# EasyEDA Pro project Choloepus.eprj, board PCB1
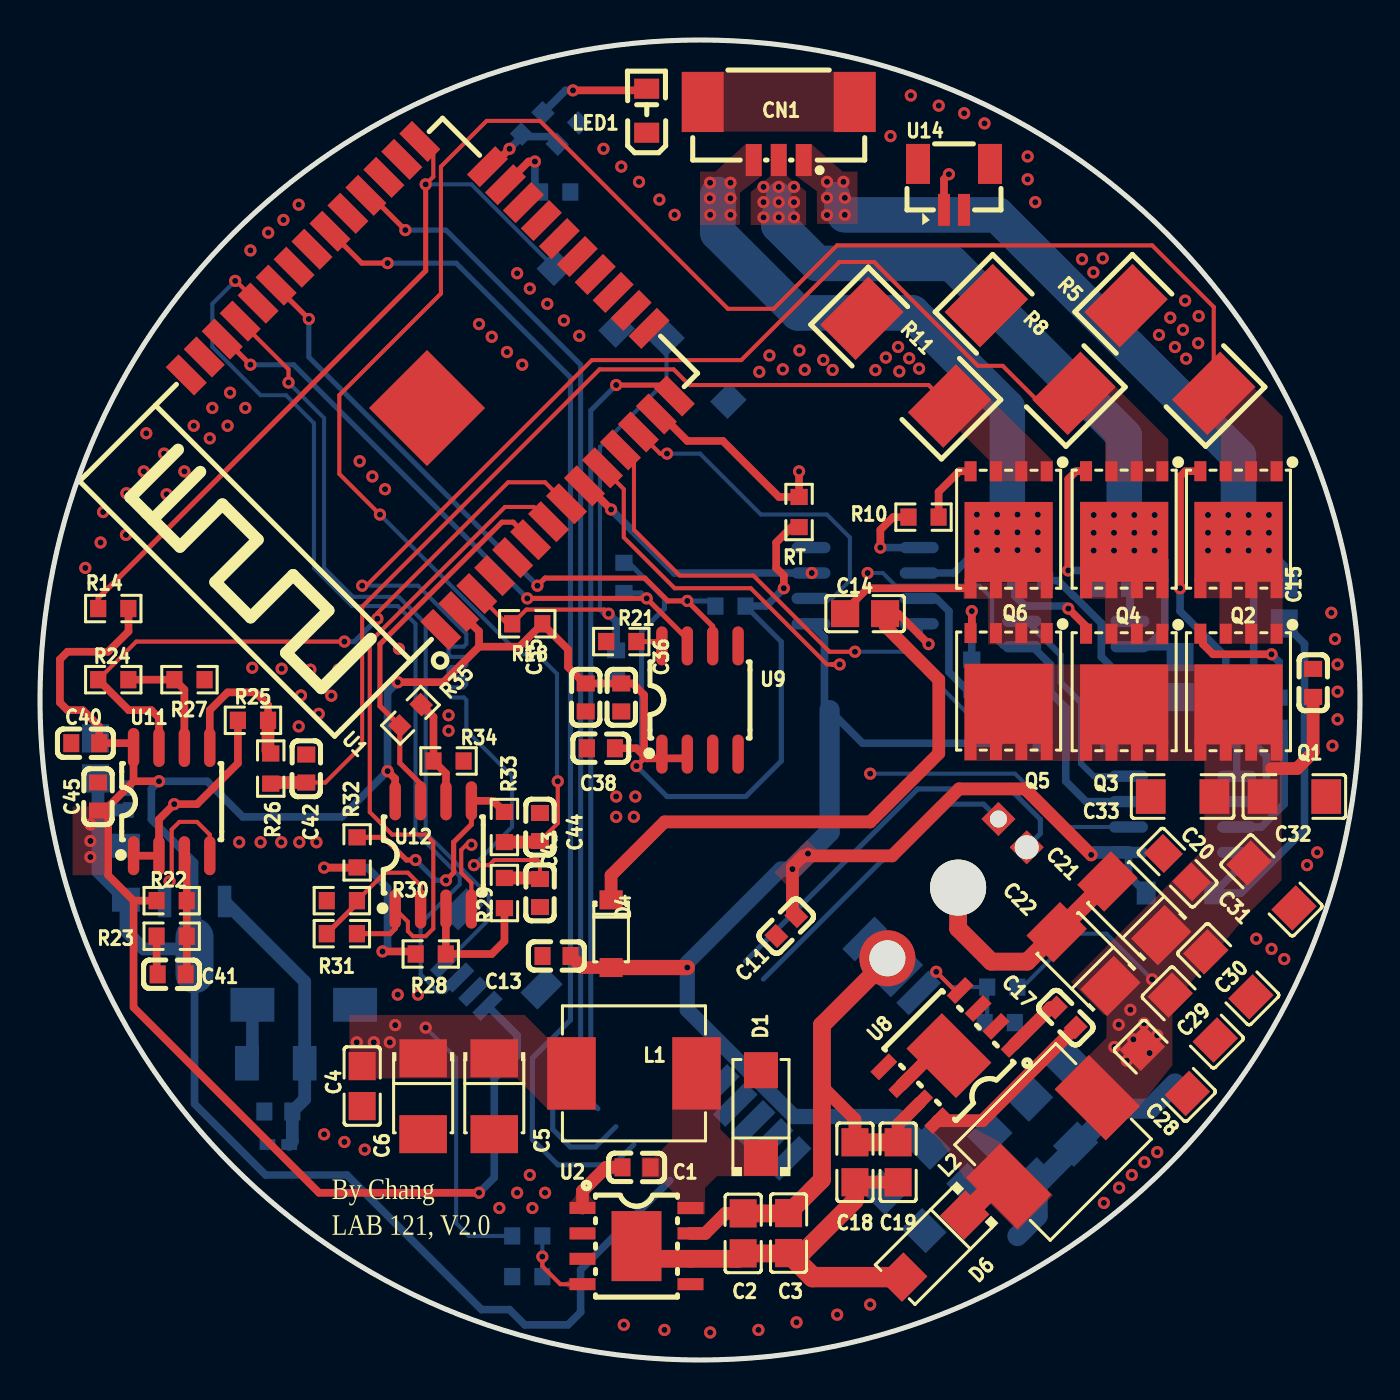
[diagram p2: board, top side]
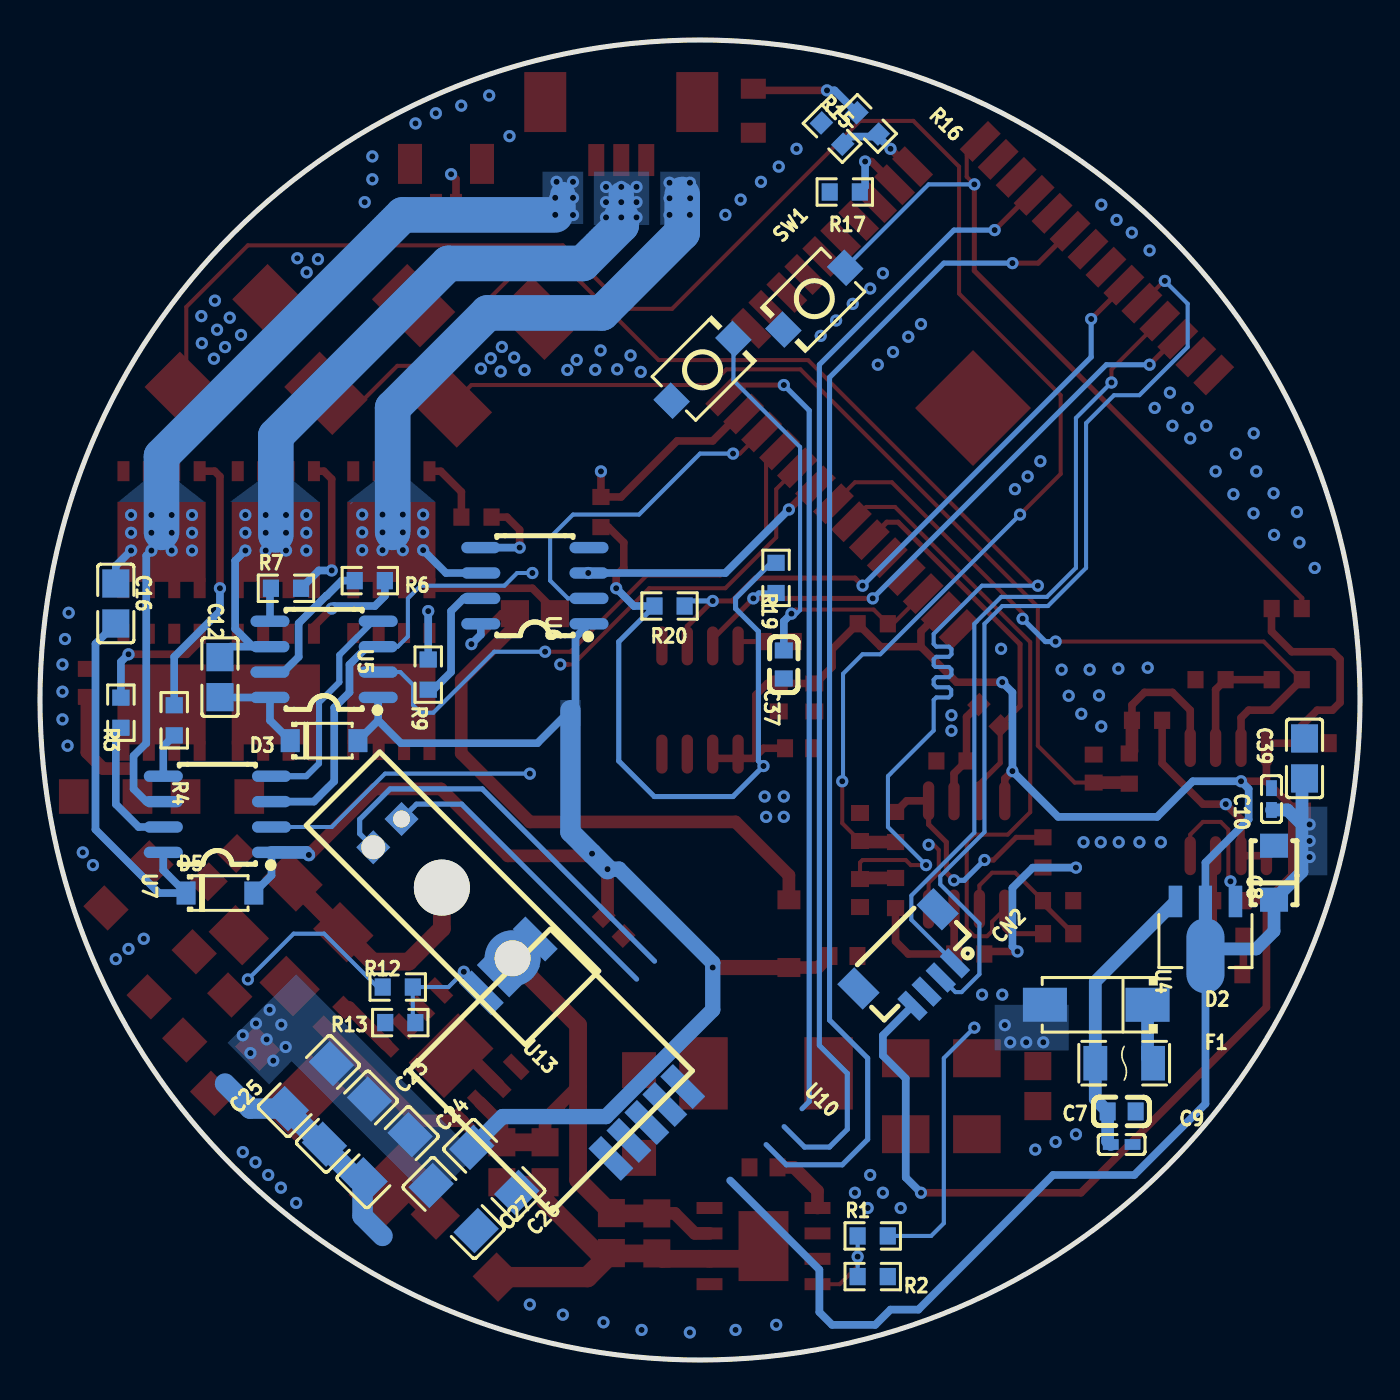
[diagram p3: board, bottom side, seen from below]

Outline 66 x 66 mm; copper layers: Top Layer, Inner1, Inner2, Inner3, Inner4, Bottom Layer. Coordinates in mm from the lower left corner of the outline.
Outline path: circle c33,33 r33
Stack: Top Layer 0.035mm 外层铜厚1oz / Dielectric1 0.0994mm 3313 RC57% 4.2mil / Inner1 0.0152mm 内层铜厚 / Dielectric2 0.55mm 0.55mm H/H不含铜 / Inner2 0.0152mm 内层铜厚 / Dielectric3 0.1088mm 2116 RC54% 4.9mil / Inner3 0.0152mm 内层铜厚 / Dielectric4 0.55mm 0.55mm H/H不含铜 / Inner4 0.0152mm 内层铜厚 / Dielectric5 0.0994mm 3313 RC57% 4.2mil / Bottom Layer 0.035mm 外层铜厚1oz

## Design rules (mm)
template: 自定义配置
spacing copperThickness1oz (default): track to track 0.102, other pairs 0.152 to 0.3
spacing copperThickness2oz: track to track 0.203, other pairs 0.152 to 0.3
track width copperThickness1oz (default): min 0.127, default 0.254, max 2.54
track width copperThickness2oz: min 0.203, default 0.254, max 2.54
differential pair differentialPair (default): width min 0.127, default 0.254, max 2.54; gap min 0.152, default 0.152
via viaSize (default): diameter min 0.5, default 0.61, max 10; hole min 0.3, default 0.305, max 6.3

## Placement (name value [footprint] x y rotation side)
C1  10nF  [C0603]  29.82 9.63 180 top
C2  10uF  [C0805]  35.16 6.33 90 top
C3  10uF  [C0805]  37.43 6.35 90 top
C4  10uF  [C0805]  16.11 13.7 90 top
C5  47uF  [CAP-SMD_L3.5-W2.8-R-RD]  22.71 13.19 90 top
C6  47uF  [CAP-SMD_L3.5-W2.8-R-RD]  19.16 13.19 90 top
C7  22uF  [C0603]  11.92 12.43 180 bottom
C8  22uF  [CAP-SMD_L3.2-W1.6]  4.3 24.36 90 bottom
C9  100nF  [C0402]  11.92 10.78 0 bottom
C10  100nF  [C0402]  4.42 28.05 270 bottom
C11  100nF  [C0603]  37.32 21.7 45 top
C12  10uF  [C0805]  57 34.14 270 bottom
C13  100nF  [C0603]  25.83 20.2 0 top
C14  10uF  [C0805]  41.25 37.32 0 top
C15  100nF  [C0603]  63.66 33.86 270 top
C16  10uF  [C0805]  62.21 37.83 270 bottom
C17  10nF  [C0603]  51.29 17.12 135 top
C18  10uF  [C0805]  40.75 9.89 90 top
C19  10uF  [C0805]  42.91 9.89 90 top
C20  10uF  [C0805]  56.88 24.62 315 top
C21  47uF  [CAP-SMD_L3.5-W2.8-R-RD]  54.72 22.59 315 top
C22  47uF  [CAP-SMD_L3.5-W2.8-R-RD]  52.18 20.05 315 top
C23  22uF  [C1206]  50.65 11.92 135 bottom
C24  22uF  [C1206]  48.62 10.14 135 bottom
C25  22uF  [C1206]  52.56 13.7 135 bottom
C26  22uF  [C1206]  43.29 9.5 45 bottom
C27  22uF  [C1206]  45.32 7.6 45 bottom
C28  22uF  [C1206]  56.24 14.46 135 top
C29  22uF  [C1206]  57.64 17.12 135 top
C30  22uF  [C1206]  59.42 19.28 135 top
C31  22uF  [C1206]  61.57 23.73 135 top
C32  22uF  [C1206]  62.72 28.17 180 top
C33  22uF  [C1206]  57.13 28.17 0 top
C35  100nF  [C0603]  27.28 33.13 270 top
C36  100nF  [C0603]  29.06 33.13 270 top
C37  100nF  [C0603]  28.81 34.78 90 bottom
C38  100nF  [C0603]  28.05 30.59 0 top
C39  10uF  [C0805]  2.77 30.08 270 bottom
C40  100nF  [C0603]  2.26 30.84 180 top
C41  100nF  [C0603]  6.58 19.28 0 top
C42  2.2nF  [C0603]  13.31 29.57 90 top
C43  2.2nF  [C0603]  25 23.35 270 top
C44  2.2nF  [C0603]  25 26.65 90 top
C45  100nF  [C0603]  2.9 28.17 90 top
CN1  YTC-A1251-03ABW  [CONN-SMD_3P-P1.25_YTC-A1251-03ABW]  36.94 61.45 180 top
CN2  YTC-A1001LF-04A  [CONN-TH_YTC-A1001LF-04A]  22.21 19.67 315 bottom
D1  B340A-13-F  [SMA_L4.4-W2.6-LS5.0-RD]  36.05 12.3 90 top
D2  SS14  [SMA_L4.2-W2.6-LS5.3-RD]  13.19 17.76 0 bottom
D3  FR107  [SOD-123_L2.8-W1.8-LS3.7-RD]  51.8 30.97 180 bottom
D4  FR107  [SOD-123_L2.8-W1.8-LS3.7-RD]  28.56 21.32 270 top
D5  FR107  [SOD-123_L2.8-W1.8-LS3.7-RD]  57 23.35 180 bottom
D6  B340A-13-F  [SMA_L4.4-W2.6-LS5.0-RD]  44.68 5.69 225 top
F1  BSMD1206-100-24V  [F1206]  11.79 14.84 0 bottom
L1  22uH  [IND-SMD_L7.0-W6.6_FXL0630]  29.7 14.33 180 top
L2  22uH  [IND-SMD_L7.0-W6.6_FXL0630]  50.65 10.9 45 top
LED1  XL-2012UGC  [LED0805-RD_GREEN]  30.33 62.46 90 top
Q1  HYG025N06LS1C2  [DFN-8_L5.9-W5.2-P1.27-LS6.2-BL]  59.92 33.39 180 top
Q2  HYG025N06LS1C2  [DFN-8_L5.9-W5.2-P1.27-LS6.2-BL]  59.92 41.52 180 top
Q3  HYG025N06LS1C2  [DFN-8_L5.9-W5.2-P1.27-LS6.2-BL]  54.21 33.39 180 top
Q4  HYG025N06LS1C2  [DFN-8_L5.9-W5.2-P1.27-LS6.2-BL]  54.21 41.52 180 top
Q5  HYG025N06LS1C2  [DFN-8_L5.9-W5.2-P1.27-LS6.2-BL]  48.43 33.42 180 top
Q6  HYG025N06LS1C2  [DFN-8_L5.9-W5.2-P1.27-LS6.2-BL]  48.43 41.51 180 top
R1  20kΩ  [R0603]  24.36 6.2 180 bottom
R2  6.46K  [R0603]  24.36 4.17 0 bottom
R3  22Ω  [R0603]  61.96 32.36 90 bottom
R4  22Ω  [R0603]  59.29 31.98 90 bottom
R5  5mΩ  [RES-SMD_L6.4-W3.2-1]  56.5 50.53 315 top
R6  22Ω  [R0603]  49.51 38.97 180 bottom
R7  22Ω  [R0603]  53.7 38.59 180 bottom
R8  5mΩ  [RES-SMD_L6.4-W3.2-1]  49.51 50.53 315 top
R9  22Ω  [R0603]  46.59 34.27 90 bottom
R10  22Ω  [R0603]  44.18 42.14 0 top
R11  5mΩ  [RES-SMD_L6.4-W3.2-1]  43.29 49.89 315 top
R12  20kΩ  [R0603]  48.11 18.65 0 bottom
R13  2.27K  [R0603]  47.99 16.87 180 bottom
R14  10kΩ  [R0603]  3.66 37.57 0 top
R15  10kΩ  [R0603]  26.4 61.32 45 bottom
R16  3.3kΩ  [R0603]  24.62 61.83 45 bottom
R17  10kΩ  [R0603]  25.76 58.4 0 bottom
R18  10kΩ  [R0603]  24.36 36.81 0 top
R19  4.7kΩ  [R0603]  29.2 39.1 90 bottom
R20  4.7kΩ  [R0603]  34.52 37.7 0 bottom
R21  10kΩ  [R0603]  29.06 35.92 0 top
R22  20kΩ  [R0603]  6.58 22.97 180 top
R23  20kΩ  [R0603]  6.58 21.19 0 top
R24  20kΩ  [R0603]  3.66 34.02 180 top
R25  20kΩ  [R0603]  10.65 31.98 0 top
R26  2kΩ  [R0603]  11.54 29.57 90 top
R27  2kΩ  [R0603]  7.47 34.02 180 top
R28  20kΩ  [R0603]  19.54 20.3 0 top
R29  2kΩ  [R0603]  23.22 23.35 270 top
R30  2kΩ  [R0603]  15.09 22.97 0 top
R31  20kΩ  [R0603]  15.09 21.32 0 top
R32  20kΩ  [R0603]  15.85 25.38 90 top
R33  2kΩ  [R0603]  23.22 26.65 90 top
R34  2kΩ  [R0603]  20.43 29.95 180 top
R35  20kΩ  [R0603]  18.52 32.24 225 top
RT  NC  [R0603]  37.95 42.4 270 top
SW1  TS-1088-AR02016  [SW-SMD_L3.9-W3.0-P4.45]  27.28 53.07 315 bottom
SW2  TS-1088-AR02016  [SW-SMD_L3.9-W3.0-P4.45]  32.87 49.51 135 bottom
U1  ESP32-WROOM-32-N4  [WIFIM-SMD_ESP32-WROOM-32-N4]  20.05 49.26 135 top
U2  TPS5430DDAR  [ESOP-8_L4.9-W3.9-P1.27-LS6.0-TL-EP]  29.82 5.69 0 top
U4  CJA1117B-3.3  [SOT-89-3_L4.5-W2.5-P1.50-LS4.2-BR]  7.73 21.57 90 bottom
U5  EG2104S  [SOIC-8_L5.0-W4.0-P1.27-LS6.0-BL]  51.8 35.03 90 bottom
U6  EG2104S  [SOIC-8_L5.0-W4.0-P1.27-LS6.0-BL]  41.25 38.72 90 bottom
U7  EG2104S  [SOIC-8_L5.0-W4.0-P1.27-LS6.0-BL]  57.13 27.28 90 bottom
U8  TPS5430DDAR  [ESOP-8_L4.9-W3.9-P1.27-LS6.0-TL-EP]  45.45 15.22 225 top
U9  AS5600-ASOT  [SOIC-8_L5.0-W4.0-P1.27-LS6.0-BL]  33 33 0 top
U10  -  [CAN-Niren-V2]  33.38 14.46 45 bottom
U11  LM358DR  [SOIC-8_L5.0-W4.0-P1.27-LS6.0-BL]  6.58 27.92 0 top
U12  LM358DR  [SOIC-8_L5.0-W4.0-P1.27-LS6.0-BL]  19.66 25.25 0 top
U13  -  [XT30PB(2+2)-M]  42.37 20.08 45 bottom
U14  XY-SH1.0-2A51  [CONN-SMD_2P-P1.00_XY-SH1.0-2A51]  45.7 58.65 0 top

## Footprints (pads in the part's own frame, mm; a bottom-side part is the same pattern mirrored in y, then rotated)
C0402
  rect 0.79x0.54 smd: 1(-0.545,0) 2(0.545,0)
C0603
  rect 0.8x0.9 smd: 1(-0.7,0) 2(0.7,0)
C0805
  rect 1.41x1.35 smd: 1(-1,0) 2(1,0)
C1206
  rect 1.485x1.728 smd: 1(-1.593,0) 2(1.593,0)
CAN-Niren-V2
  rect 2.286x0.889 smd: 1(-0.216,5.975) 2(-0.216,4.704) 3(-0.216,3.434) 4(-0.216,2.164) 5(-0.215,0.895) 6(10.216,0.894) 7(10.216,2.164) 8(10.216,3.434) 9(10.216,4.704)
CAP-SMD_L3.2-W1.6
  rect 1.2x1.4 smd: 1(-1.35,0) 2(1.35,0)
CAP-SMD_L3.5-W2.8-R-RD
  rect 1.9x2.376 smd: 1(1.899,0) 2(-1.899,0)
CONN-SMD_2P-P1.00_XY-SH1.0-2A51
  rect 0.6x1.6 smd: 1(-0.5,-1.15) 2(0.5,-1.15)
  rect 1.2x2 smd: 3(1.8,1.15) 4(-1.8,1.15)
CONN-SMD_3P-P1.25_YTC-A1251-03ABW
  rect 0.8x1.6 smd: 1(-1.25,1.45) 2(0,1.45) 3(1.25,1.45)
  rect 2.1x3 smd: 4(-3.8,-1.45) 5(3.8,-1.45)
CONN-TH_YTC-A1001LF-04A
  rect 0.6x1.55 smd: 1(-1.5,1.262) 2(-0.5,1.262) 3(0.5,1.262) 4(1.5,1.262)
  rect 1.2x1.8 smd: 5(2.8,-1.262) 6(-2.8,-1.262)
DFN-8_L5.9-W5.2-P1.27-LS6.2-BL
  rect 0.6x1 smd: 1(-1.905,-2.925) 2(-0.635,-2.925) 3(0.635,-2.925) 4(1.905,-2.925) 5(1.905,2.925) 6(0.635,2.925) 7(-0.635,2.925) 8(-1.905,2.925)
  rect 4.41x4 smd: 9(0,0.61)
ESOP-8_L4.9-W3.9-P1.27-LS6.0-TL-EP
  rect 1.3x0.6 smd: 1(-2.7,1.905) 2(-2.7,0.635) 3(-2.7,-0.635) 4(-2.7,-1.905) 5(2.7,-1.905) 6(2.7,-0.635) 7(2.7,0.635) 8(2.7,1.905)
  rect 2.5x3.5 smd: 9(0,0)
F1206
  rect 1.19x1.728 smd: 1(-1.445,0) 2(1.445,0)
IND-SMD_L7.0-W6.6_FXL0630
  rect 2.424x3.62 smd: 1(3.128,0) 2(-3.128,0)
LED0805-RD_GREEN
  rect 1x1.25 smd: 1(-1.1,0) 2(1.1,0)
R0603
  rect 0.806x0.864 smd: 1(-0.753,0) 2(0.753,0)
RES-SMD_L6.4-W3.2-1
  rect 2.5x3.4 smd: 1(-3.1,0) 2(3.1,0)
SMA_L4.2-W2.6-LS5.3-RD
  rect 2.2x1.7 smd: 1(-2.566,0) 2(2.566,0)
SMA_L4.4-W2.6-LS5.0-RD
  rect 1.8x1.7 smd: 1(-2.192,0) 2(2.192,0)
SOD-123_L2.8-W1.8-LS3.7-RD
  rect 0.95x1.15 smd: 1(-1.692,0) 2(1.692,0)
SOIC-8_L5.0-W4.0-P1.27-LS6.0-BL
  oval 0.569x1.95 smd: 1(-1.905,-2.705) 2(-0.635,-2.705) 3(0.635,-2.705) 4(1.905,-2.705) 5(1.905,2.705) 6(0.635,2.705) 7(-0.635,2.705) 8(-1.905,2.705)
SOT-89-3_L4.5-W2.5-P1.50-LS4.2-BR
  rect 1.575x0.672 smd: 1(1.356,-1.5) 3(1.356,1.5)
  custom 5.377x1.9 smd: 2(-1.356,0)
SW-SMD_L3.9-W3.0-P4.45
  rect 1.23x1.36 smd: 1(-2.185,0) 2(2.185,0)
WIFIM-SMD_ESP32-WROOM-32-N4
  rect 2x0.9 smd: 1(-9,9.005) 2(-9,7.735) 3(-9,6.465) 4(-9,5.195) 5(-9,3.925) 6(-9,2.655) 7(-9,1.385) 8(-9,0.115) 9(-9,-1.155) 10(-9,-2.425) 11(-9,-3.695) 12(-9,-4.965) 13(-9,-6.235) 14(-9,-7.505) 25(9,-7.505) 26(9,-6.235) 27(9,-4.965) 28(9,-3.695) 29(9,-2.425) 30(9,-1.155) 31(9,0.115) 32(9,1.385) 33(9,2.655) 34(9,3.925) 35(9,5.195) 36(9,6.465) 37(9,7.735) 38(9,9.005)
  rect 0.9x2 smd: 15(-5.715,-9.005) 16(-4.445,-9.005) 17(-3.175,-9.005) 18(-1.905,-9.005) 19(-0.635,-9.005) 20(0.635,-9.005) 21(1.905,-9.005) 22(3.175,-9.005) 23(4.445,-9.005) 24(5.715,-9.005)
  rect 4.1x4.1 smd: 39(-0.68,1.665)
XT30PB(2+2)-M
  round 2.8 hole 1.8: 1(0,0)
  round 2.8 hole 2.8x1.8: 2(5,0)
  rect 1.2x1.2 hole 1.8x0.85: 3(8.85,1)
  rect 1.2x1.2 hole 0.85: 4(8.85,-1)

## Nets
As in the schematic, except:
3V3: C8.1 C10.2 C35.1 C36.1 C38.2 C39.2 C40.1 C45.1 CN2.4 R14.2 R18.2 R19.2 R20.2 R22.2 RT.2 U1.2 U4.2 U9.1 U9.2 U10.1 U11.8 U12.8
TEMP: RT.1 U1.13 U14.1

Pads without a net: CN1 4 5; CN2 5 6; U1 4 5 16 17 18 19 20 21 22 26 27 29 31 32 37; U2 2 3 5; U8 2 3 5; U9 3 5; U10 9; U14 3 4

## Via types
v1: diameter 0.61, hole 0.305, Top Layer to Bottom Layer, 254 vias

## Routing (per net, layer and track width the routed paths; a pad name or vN(x,y) marks a point on that pad's centre or on a via; arc(x,y) is an arc through that point)
1V65: length 29.4
  Top Layer w0.381: R32.1 15.85,24.62 v1(14.2,24.62) ; v1(17.12,20.43) 18.66,20.43 R28.1 ; U11.1 U11.2 5.95,27.03 v1(6.71,27.79) 7.85,27.79 9.89,29.83 R25.1
  Inner2 w0.381: v1(14.2,24.62) 9.89,24.62 v1(6.71,27.79)
  Bottom Layer w0.381: v1(14.2,24.62) 16.36,24.62 17.38,23.6 17.38,20.68 v1(17.12,20.43)
3V3: length 204.6
  Top Layer w0.254: v1(29.82,29.7) 30.21,30.08 30.21,30.21
  Top Layer w0.381: 4.68,22.97 4.68,17.63 13.95,8.36 v1(21.95,8.36) ; 4.68,22.97 3.41,24.24 3.41,27.67 4.68,28.94 ; 4.68,22.97 R22.2 ; v1(5.95,28.94) 4.68,28.94 ; 4.68,28.94 U11.8 4.46,30.84 C40.1 2.96,31.67 2.14,32.49 1.38,32.49 1,32.87 1,35.03 1.38,35.41 3.41,35.41 4.42,36.43 4.42,37.56 R14.2 ; U1.2 20.96,37.42 21.95,36.43 21.95,35.67 ; U9.2 32.15,30.08 30.88,30.08 ; 21.95,35.67 20.17,33.89 v1(17.89,33.89) ; 21.95,35.67 23.97,35.67 R18.2 26.4,35.53 26.4,34.65 27.22,33.83 C35.1 C36.1 29.63,33.83 30.21,33.25 30.21,30.21 ; 30.88,30.08 30.33,30.08 30.21,30.21 ; 30.88,30.08 U9.1 ; 30.21,30.21 29.82,30.59 C38.2 ; v1(17.38,29.44) 17.76,29.06 U12.8 ; RT.2 37.58,41.64 36.81,40.87 36.81,39.6 37.19,39.22 v1(37.19,38.59)
  Bottom Layer w0.254: R19.2 29.44,39.86 31.22,38.08 31.22,37.57 30.08,36.43 30.08,29.95 v1(29.82,29.7) 31.35,28.17 35.29,28.17 37.06,29.95 37.06,35.91 R20.2
  Bottom Layer w0.381: 31.49,8.97 27.03,4.52 27.03,2.39 26.4,1.76 24.24,1.76 23.47,2.52 22.08,2.52 15.35,9.25 11.28,9.25 7.73,12.81 U4.2 7.73,24.87 5.57,27.03 5.57,28.56 v1(5.95,28.94) 8.36,28.94 10.14,27.16 15.09,27.16 v1(17.38,29.44) 17.38,33.38 v1(17.89,33.89) ; CN2.4 23.86,16.23 23.86,15.22 22.71,14.08 22.71,9.12 v1(21.95,8.36) ; v1(37.19,38.59) 36.3,37.7 R20.2
  Bottom Layer w0.635: C39.2 2.9,28.95 2.9,26.78 ; U4.2 7.39,20.55 5.19,20.55 4.3,21.44 C8.1 2.9,24.41 2.9,26.78 ; 2.9,26.78 3.63,27.5 C10.2
  vias: v1(2.52,26.78) v1(2.52,25.95) v1(2.52,25.15)
5V: length 13.5
  Bottom Layer w0.203: R1.2 21.44,6.2 20.81,6.84 20.81,15.09 v1(19.28,16.62)
  vias: v1(15.84,15.88) v1(16.69,15.88) v1(17.49,15.88) v1(17.76,16.74)
12V: length 95.9
  Top Layer w0.635: C13.2 27.1,19.62 D4.2 ; v1(52.56,25.25) 49.26,28.56 45.95,28.56 42.61,25.21 38.16,25.21 37.62,24.67 v1(37.62,24.54) 37.62,22.38 C11.2 ; 61.57,29.57 62.84,29.57 63.66,30.38 C15.2
  Top Layer w0.762: D4.2 v1(32.37,19.62)
  Bottom Layer w0.203: 49,18.52 51.8,21.32 53.32,21.32 v1(55.61,19.03)
  Bottom Layer w0.381: 39.22,32.49 39.22,36.14 U6.1 ; 39.48,32.49 41.13,30.84 47.95,30.84 49.09,31.98 ; D5.2 54.43,24.23 U7.1 ; 49.09,31.98 49.09,33.13 ; 49.09,31.98 D3.2
  Bottom Layer w0.635: U7.1 52.69,25.38 v1(52.56,25.25)
  Bottom Layer w0.762: 44.41,10.63 42.87,12.17 37.7,12.17 32.37,17.51 32.37,19.86 37.05,24.54 v1(37.62,24.54)
  Bottom Layer w1.016: 39.48,32.49 39.48,26.4 v1(38.4,25.32) v1(37.62,24.54)
  vias: v1(53.72,15.65) v1(53.93,16.77) v1(54.34,14.97) v1(54.52,17.51) v1(54.67,16.03) v1(55.2,16.83) v1(55.48,15.35) v1(55.86,16.24)
GND: length 71.5
  Top Layer w0.203: v1(6.48,23.93) 6.58,24.04 6.58,26.52 6.97,26.9 7.85,26.9 8.49,26.27 U11.4 ; U12.4 21.57,23.86 21.06,24.36 21.06,25.51 21.32,25.76 v1(21.57,25.76)
  Top Layer w0.381: R23.1 5.83,19.34 C41.1
  Top Layer w0.635: U8.9 44.55,15.22 U8.6 ; 40.67,8.89 42.92,8.89 42.93,8.88
  Top Layer w0.889: U2.9 30.46,5.06 U2.6 34.89,5.06 C2.1 37.41,5.33 C3.1 38.11,5.35 40.75,7.98 C18.1 ; C21.2 C22.2 49.37,19.92 47.56,19.92 45.91,21.58 U13.2
  Top Layer w1.016: C3.1 38.63,4.14 D6.2
  Bottom Layer w0.305: 49.09,36.94 49.34,36.94 51.03,35.25 51.03,33.89 52.05,32.87 52.05,29.83 52.69,29.19 U7.4
  Bottom Layer w1.016: 56.75,13.82 55.5,12.57 C25.1 50.13,9.01 49.87,9.01 49.87,7.2 48.88,6.2
  vias: v1(2.27,39.6) v1(3.03,40.87) v1(3.16,42.4) v1(4.32,43.34) v1(4.3,41.25) v1(5.19,44.43) v1(5.31,46.33) v1(5.32,42.33) v1(6.2,45.32) v1(6.33,43.29) v1(7.22,44.43) v1(7.69,46.71) v1(8.49,46.08) v1(8.62,47.61) v1(9.38,46.71) v1(9.5,48.37) v1(9.96,25.89) v1(10.27,47.61) v1(10.52,55.48) v1(10.61,34.61) v1(11.03,25.89) v1(11.41,56.37) v1(12.08,34.57) v1(12.06,25.89) v1(12.17,57) v1(12.93,57.77) v1(12.94,31.68) v1(13.05,33.23) v1(12.96,25.89) v1(13.52,34.52) v1(13.82,25.89) v1(13.94,32.31) v1(14.2,11.28) v1(14.57,33.21) v1(14.92,34.52) v1(15.22,10.9) v1(15.98,44.94) v1(16.24,10.52) v1(16.62,44.18) v1(17.25,43.54) v1(17.95,35.56) v1(17.89,18.27) v1(18.9,18.27) v1(20.43,32.24) v1(20.43,31.46) v1(21.95,51.8) v1(22.59,51.16) v1(22.97,7.6) v1(23.35,50.4) v1(23.86,54.34) v1(23.86,8.36) v1(24.11,49.76) v1(24.49,53.57) v1(24.49,9.25) v1(24.62,7.6) v1(25.25,8.36) v1(25.36,52.81) v1(26.19,51.98) v1(26.96,51.21) v1(28.17,60.56) v1(28.81,28.17) v1(28.81,27.16) v1(29.06,59.67) v1(29.19,1.76) v1(29.69,27.16) v1(29.77,28.17) v1(29.95,58.91) v1(30.97,58.02) v1(31.22,1.5) v1(31.73,57.26) v1(33.51,1.38) v1(35.92,1.5) v1(35.96,49.41) v1(36.47,50.23) v1(37.14,49.53) v1(37.83,1.88) v1(37.97,50.48) v1(38.24,49.51) v1(39.17,50) v1(39.63,49.5) v1(39.86,2.27) v1(41.51,2.77) v1(41.77,49.49) v1(42.29,50.12) v1(42.53,61.19) v1(42.91,50.65) v1(42.97,49.43) v1(43.54,63.23) v1(43.46,50.09) v1(43.96,49.57) v1(44.94,62.72) v1(46.21,62.34) v1(47.22,61.83) v1(49.38,60.18) v1(49.38,59.03) v1(49.76,57.89) v1(52.1,55.04) v1(52.67,54.38) v1(53.13,55.09) v1(53.19,7.85) v1(53.96,8.62) v1(54.59,9.25) v1(55.22,9.89) v1(55.95,51.25) v1(55.86,10.39) v1(56.51,52.12) v1(56.75,50.65) v1(57.15,51.51) v1(57.26,52.97) v1(57.3,50.07) v1(57.93,52.2) v1(57.91,50.84) v1(60.81,21.06) v1(61.57,20.55) v1(62.21,20.05) v1(63.35,24.75) v1(63.86,25.38) v1(64.57,37.36) v1(64.62,30.71) v1(64.75,36.05) v1(64.88,34.78) v1(64.88,33.42) v1(64.88,32.03)
VIN: length 28.2
  Top Layer w0.635: U2.7 33.26,6.33 34.26,7.33 C2.2 ; C18.2 40.75,12.03 39.1,13.68 ; C19.2 42.91,11.78 U8.7
  Top Layer w0.889: C2.2 37.41,7.33 C3.2 39.1,9.01 39.1,16.74 42.37,20.02 U13.1 ; C18.2 C19.2
CAN_H: length 20.6
  Bottom Layer w0.254: U13.3 50.02,26.32 50.02,27.03 48.49,28.56 43.89,28.56 35.27,19.94
CAN_L: length 15.7
  Bottom Layer w0.254: 36.17,19.04 44.92,27.79 47.18,27.79 U13.4
EN_MOS: length 38
  Top Layer w0.203: v1(41.38,39.35) 41.51,39.48
  Top Layer w0.381: U1.9 27.37,43.71 v1(28.56,42.53)
  Inner4 w0.254: v1(38.59,39.35) v1(41.38,39.35)
  Bottom Layer w0.203: 49.09,35.67 48.11,35.67 47.6,36.17 47.6,38.08 46.97,38.72 42.78,38.72 42.14,39.35 v1(41.38,39.35)
  Bottom Layer w0.381: U7.3 52.3,27.92 51.29,28.94 51.29,32.62 50.53,33.38 50.53,34.77 49.63,35.67 49.09,35.67 ; v1(38.59,39.35) U6.3 31.73,39.35 v1(28.56,42.53)
GH_A: length 6.8
  Bottom Layer w0.381: U7.7 61.07,26.65 62.21,27.79 62.21,31.36 R3.1
GH_B: length 7.1
  Bottom Layer w0.381: U5.7 53.83,34.4 53.07,35.16 53.07,36.84 51.68,38.22 51.66,38.22 50.91,38.97 R6.1
GH_C: length 6.3
  Bottom Layer w0.381: R9.1 46.33,33.52 45.45,34.4 45.45,37.44 44.81,38.08 U6.7
GL_A: length 2.3
  Bottom Layer w0.381: U7.5 59.84,30.68 R4.1
GL_B: length 1.7
  Bottom Layer w0.381: R7.1 54.5,38.54 U5.5
GL_C: length 4.5
  Top Layer w0.381: v1(42.02,40.62) 42.02,41.51 42.65,42.14 R10.1
  Bottom Layer w0.381: U6.5 v1(42.02,40.62)
ISEN_A: length 19.1
  Top Layer w0.254: U12.7 19.03,28.81 17.99,29.85 R35.2 17,32.7 17,35.79 23.09,41.89 23.66,41.89 U1.6
ISEN_B: length 34.6
  Top Layer w0.203: U1.7 24.69,42.65 23.25,42.65 16.49,35.89 16.49,27.39 17.61,26.27 19.28,26.27 19.66,25.89 19.66,21.57 19.28,21.19 18.65,21.19 18.4,21.44 18.4,21.91 U12.1
  Top Layer w0.254: U12.1 17.76,21.57 17.51,21.32 R31.2
ISEN_C: length 33.4
  Top Layer w0.203: U1.8 25.25,43.89 23.41,43.89 16.87,37.35 v1(16.87,37.06) ; v1(15.22,35.92) 4.81,35.92 R24.2
  Top Layer w0.381: U11.7 5.95,32.11 5.57,32.49 4.43,32.49 R24.2
  Bottom Layer w0.254: v1(16.87,37.06) 15.73,35.92 v1(15.22,35.92)
OUT_A: length 45.7
  Bottom Layer w0.381: U7.6 60.69,27.92 61.32,28.56 61.32,30.21 60.69,30.84 60.69,40.22 v1(60.43,40.47) ; v1(61.45,40.47) 62.21,39.71 C16.1
  Bottom Layer w1.27: v1(40.24,57.26) 39.86,57.64 39.86,58.27
  Bottom Layer w1.778: v1(40.24,57.26) 47.86,57.26 59.92,45.19 59.92,41.38
  vias: v1(39.35,58.91) v1(39.35,58.11) v1(39.35,57.25) v1(40.17,58.91) v1(40.24,58.11) v1(58.4,42.25) v1(58.4,41.36) v1(58.4,40.47) v1(59.41,42.25) v1(59.41,41.36) v1(59.41,40.47) v1(60.43,42.25) v1(60.43,41.36) v1(61.45,42.25) v1(61.45,41.36)
OUT_B: length 36.2
  Bottom Layer w0.381: 55.35,35.67 56.48,35.67 C12.1 ; 55.35,35.67 56.24,36.56 56.24,39.96 v1(55.73,40.47) ; 55.35,35.67 U5.6
  Bottom Layer w1.27: 36.94,58.27 v1(36.94,57.89) v1(36.94,57.13)
  Bottom Layer w1.778: 54.21,41.25 54.21,46.21 45.59,54.83 38.86,54.83 36.94,56.75 v1(36.94,57.13)
  vias: v1(36.18,58.65) v1(36.18,57.89) v1(36.18,57.13) v1(36.94,58.65) v1(37.7,58.65) v1(37.7,57.89) v1(37.7,57.13) v1(52.68,42.25) v1(52.68,41.36) v1(52.68,40.47) v1(53.7,42.25) v1(53.7,41.36) v1(53.7,40.47) v1(54.72,42.25) v1(54.72,41.36) v1(54.72,40.47) v1(55.73,42.25) v1(55.73,41.36)
OUT_C: length 36.3
  Top Layer w0.381: 40.56,37.32 40.56,37.76 41.38,38.59 Q6.5
  Bottom Layer w0.381: v1(46.84,40.49) 45.7,39.35 U6.6
  Bottom Layer w1.778: 33.89,58.27 33.89,56.37 37.9,52.36 43.62,52.36 48.37,47.61 48.37,41.38
  vias: v1(33.5,58.86) v1(33.49,58.09) v1(33.51,57.26) v1(34.52,58.86) v1(34.52,58.09) v1(34.52,57.26) v1(46.84,42.27) v1(46.84,41.38) v1(47.86,42.27) v1(47.86,41.38) v1(47.86,40.49) v1(48.88,42.27) v1(48.88,41.38) v1(48.88,40.49) v1(49.89,42.27) v1(49.89,41.38) v1(49.89,40.49)
PWM1: length 38.1
  Top Layer w0.203: U1.10 29.19,43.54 29.19,41.13 31.73,38.59 35.54,38.59 39.35,34.78 39.6,34.78
  Top Layer w0.254: v1(39.99,34.78) 39.6,34.78
  Inner3 w0.254: v1(41.51,29.32) 39.22,31.6 39.22,34.02 v1(39.99,34.78)
  Bottom Layer w0.203: U7.2 51.41,26.65 48.75,29.32 v1(41.51,29.32)
PWM2: length 28.9
  Top Layer w0.203: U1.11 29.7,44.83 29.7,41.51 31.98,39.22 35.67,39.22 39.48,35.41 v1(40.75,35.41)
  Bottom Layer w0.203: 49.09,34.4 47.99,34.4 47.35,33.76 47.35,32.75 46.97,32.36 46.34,32.36 43.29,35.41 v1(40.75,35.41)
PWM3: length 17.2
  Top Layer w0.203: v1(31.35,45.32) 31,45.32 U1.12
  Bottom Layer w0.203: U6.2 39.6,38.08 40.49,38.97 40.49,41.13 39.35,42.27 36.05,42.27 33,45.32 v1(31.35,45.32)
RST: length 25
  Top Layer w0.203: v1(28.43,37.32) 28.22,37.52 24.32,37.52 R18.1 23.35,36.81 U1.3
  Bottom Layer w0.203: SW2.2 31.33,48.98 28,45.65 28,37.5 28.17,37.32 v1(28.43,37.32)
  Bottom Layer w0.381: C37.2 28.81,36.94 v1(28.43,37.32)
RX0: length 47.4
  Top Layer w0.203: v1(9.76,53.95) 9.8,53.95 U1.34
  Bottom Layer w0.203: CN2.2 20.23,18.39 19.92,18.39 19.03,19.28 19.03,21.82 20.99,23.78 20.99,24.19 18.78,26.4 18.78,36.81 17.89,37.7 15.6,37.7 13.7,39.6 13.7,46.84 12.3,48.24 11.03,48.24 8.62,50.65 8.62,52.81 v1(9.76,53.95)
RX1: length 57
  Top Layer w0.254: 16.29,58.23 16.53,58.23 v1(18.27,56.5)
  Bottom Layer w0.254: 28.79,11.67 27.77,10.65 26.52,10.65 25.63,11.54 25.63,14.33 27.03,15.73 27.03,49.76 20.3,56.5 v1(18.27,56.5)
SA_A+: length 93.4
  Top Layer w0.203: C44.1 25.89,26.84 v1(25.89,28.94) ; R5.2 58.69,52.65 55.61,55.73 39.86,55.73 36.68,52.56 34.4,52.56 25,61.96 22.33,61.96 20.05,59.67 20.05,53.32 14.97,48.24 14.97,44.3 v1(17,42.27)
  Top Layer w0.635: R33.1 24.95,25.9 C44.1
  Bottom Layer w0.203: v1(17,42.27) 23.98,35.29 24.87,35.29 25.85,34.31 25.85,28.97 v1(25.89,28.94)
SA_B+: length 73.3
  Top Layer w0.203: v1(16.11,38.72) 16.31,38.72 27.6,50 35.07,50 39.97,54.9 41.71,54.9 46.9,49.71 48.14,49.71 49.83,48.02 ; v1(21.7,24.75) 22.46,24.75 22.71,25 24.87,25 25,24.87 C43.1
  Top Layer w0.635: R29.1 24.95,24.1 C43.1
  Bottom Layer w0.203: v1(21.7,24.75) 23.6,26.65 23.6,29.19 21.32,31.48 21.32,33 21.19,33.13 20.57,33.13 20.44,33.25 20.44,33.51 20.57,33.64 21.17,33.64 21.32,33.78 21.32,34.02 21.19,34.14 20.55,34.14 20.43,34.27 20.43,34.52 20.55,34.65 21.23,34.65 21.32,34.74 21.32,35.03 21.19,35.16 20.55,35.16 20.43,35.29 20.43,35.54 20.55,35.67 21.18,35.67 21.32,35.8 21.32,36.3 18.9,38.72 v1(16.11,38.72)
SA_C+: length 47.4
  Top Layer w0.203: 45.48,47.7 44.43,48.75 32.46,48.75 31.68,49.53 27.98,49.53 16.11,37.66 16.11,30.71 14.27,28.87 C42.1
  Top Layer w0.635: C42.1 11.59,28.87 R26.1
SCL: length 31.1
  Top Layer w0.254: U9.7 32.37,36.05 v1(30.33,38.08) v1(24.36,38.08) ; v1(10.52,49.76) 9.24,51.05 U1.36
  Bottom Layer w0.254: R19.1 30.06,38.35 v1(30.33,38.08) ; v1(10.52,49.76) 12.68,49.76 v1(24.36,38.08)
SDA: length 32.8
  Top Layer w0.254: v1(24.87,38.72) 25.25,39.1 30.24,39.1 31.39,37.95 v1(32.37,37.95) 33.63,36.68 U9.6 ; U1.33 11.8,53.69 v1(13.44,52.05)
  Bottom Layer w0.254: v1(24.87,38.72) 13.44,50.14 v1(13.44,52.05) ; v1(32.37,37.95) 33.52,37.95 R20.1
TEMP: length 31.9
  Top Layer w0.381: U14.1 45.2,59.04 v1(45.45,59.29) ; U1.13 31.02,47.3 32.37,45.95 34.14,45.95 36.95,43.15 RT.1 v1(37.95,44.43)
  Inner1 w0.381: v1(45.45,59.29) 46.08,58.65 46.08,50.14 44.3,48.37 41.89,48.37 v1(37.95,44.43)
TR: length 40
  Top Layer w0.254: 31.72,48.2 31.17,48.75 v1(28.81,48.75)
  Bottom Layer w0.254: v1(28.81,48.75) 27.54,47.48 27.54,12.92 27.9,12.57
TX0: length 39.5
  Top Layer w0.203: v1(12.43,48.88) 12.43,49.53 U1.35
  Bottom Layer w0.203: CN2.1 22.43,22.01 22.43,23.22 19.28,26.37 19.28,36.81 17.94,38.16 15.65,38.16 14.2,39.6 14.2,47.1 v1(12.43,48.88)
TX1: length 60
  Top Layer w0.254: v1(17.38,54.84) 16.09,54.84 U1.30
  Bottom Layer w0.254: 29.69,10.77 28.68,9.76 25.89,9.76 24.62,11.03 24.62,15.09 26.52,17 26.52,49.13 20.81,54.84 v1(17.38,54.84)
$1N650: length 3.3
  Top Layer w0.635: C1.2 28.3,9.63 27.12,8.46 U2.1
$1N1371: length 4.9
  Top Layer w0.203: v1(25.12,5.17) 25.12,4.69 26.01,3.79 U2.4
  Bottom Layer w0.203: R1.1 v1(25.12,5.17) R2.2
$1N1971: length 14.1
  Bottom Layer w0.635: C9.2 12.62,10.93 C7.1 13.24,13.04 F1.2 13.24,18.92 U4.3
$1N1973: length 3
  Bottom Layer w0.635: D2.1 10.62,15.12 F1.1
$1N2491: length 5.1
  Bottom Layer w0.381: C12.2 56.99,33.13 U5.8 54.5,31.98 D3.1
$1N2701: length 32.5
  Top Layer w0.381: v1(44.43,35.79) 42.91,37.32 C14.2 41.96,37.32
  Top Layer w0.635: D4.1 28.56,24.24 31.22,26.9 41.51,26.9 44.94,30.33 44.94,34.02 42.25,36.7 C14.2
  Bottom Layer w0.381: U6.8 43.96,36.26 v1(44.43,35.79)
$1N2890: length 19.1
  Bottom Layer w0.381: C16.2 63.23,35.81 63.23,26.52 60.05,23.35 D5.1 59.84,24.49 U7.8
$1N3593: length 6.5
  Top Layer w0.381: v1(61.57,35.29) 58.65,35.29 58.15,35.79 58.15,36.19 Q1.4
  Bottom Layer w0.381: v1(61.57,35.29) 61.96,34.91 R3.2
$1N3664: length 13.5
  Top Layer w0.381: Q2.4 57.27,44.44 57,44.18 v1(57,38.59)
  Bottom Layer w0.381: v1(57,38.59) 57,37.44 59.29,35.16 R4.2
$1N4096: length 5.3
  Top Layer w0.381: Q3.4 52.3,36.68 v1(51.41,37.57)
  Bottom Layer w0.381: v1(51.41,37.57) 51.29,37.7 49.26,37.7 48.76,38.2 R6.2
$1N4107: length 7.5
  Top Layer w0.381: v1(51.41,39.48) 51.41,44.05 51.81,44.44 Q4.4
  Bottom Layer w0.381: R7.2 52.06,39.48 v1(51.41,39.48)
$1N4356: length 3.5
  Top Layer w0.381: v1(46.59,37.44) 46.59,36.41 Q5.4
  Bottom Layer w0.381: R9.2 v1(46.59,37.44)
$1N4367: length 3.3
  Top Layer w0.381: R10.2 44.93,43.41 45.96,44.44 Q6.4
$1N5511: length 38.8
  Top Layer w0.203: U1.25 19.66,60.25 19.66,59.16 v1(19.28,58.78)
  Top Layer w0.254: v1(19.28,58.78) 19.28,54.46 2.91,38.09 R14.1
  Bottom Layer w0.203: SW1.1 21.57,58.78 v1(19.28,58.78)
$1N5798: length 4.4
  Top Layer w0.381: v1(23.47,60.56) 22.58,59.66 U1.24
  Bottom Layer w0.381: v1(23.47,60.56) 24.09,61.17 ; 24.09,61.17 25.48,61.17 R15.1 ; 24.09,61.17 R16.1
$1N5805: length 5.7
  Top Layer w0.381: v1(26.65,63.48) 30.25,63.48 LED1.2
  Bottom Layer w0.381: R16.2 26.27,63.48 v1(26.65,63.48)
$1N5929: length 3.6
  Top Layer w0.381: v1(24.75,59.92) 24.43,59.92 U1.23
  Bottom Layer w0.381: R17.1 24.75,58.66 v1(24.75,59.92)
$1N7274: length 1.4
  Top Layer w0.254: R21.2 30.88,35.92 U9.8
$2N446: length 2.9
  Top Layer w0.635: U8.1 50.54,17.62 50.79,17.62
$2N447: length 11.6
  Top Layer w0.635: 51.78,16.63 47.12,11.96 U8.8
  Top Layer w1.016: D6.1 47.68,8.69 48.44,8.69
$2N452: length 6.1
  Top Layer w0.203: U8.4 45.75,18.48 v1(44.81,19.41)
  Bottom Layer w0.203: 47.36,17 R12.1 45.57,18.65 v1(44.81,19.41)
$2N1488: length 6
  Top Layer w0.381: C41.2 7.34,19.34 R23.2 R22.1 7.34,25.1 U11.3
$2N1627: length 7.9
  Top Layer w0.381: R25.2 11.4,32.75 10.78,33.38 9.38,33.38 8.49,32.49 U11.5
  Top Layer w0.635: R26.2 11.4,30.46 R25.2
$2N1790: length 5.9
  Top Layer w0.381: U11.6 7.22,33.52 R27.2 R24.1
$2N2142: length 6.7
  Top Layer w0.381: R28.2 22.59,20.3 23.22,20.94 R29.2 ; 20.29,20.68 20.29,22.54 U12.3
$2N2146: length 7.5
  Top Layer w0.203: R30.2 17.24,24.36 18.4,24.36 19.03,23.73 U12.2
  Top Layer w0.254: R30.2 15.85,22.82 R31.1
$2N2347: length 11.7
  Top Layer w0.254: U12.5 21.57,26.78 20.68,25.89 20.68,24.36 v1(20.3,23.98) ; R32.2 17.19,26.13 18.33,25 v1(18.78,25)
  Top Layer w0.381: R33.2 22.67,27.96 U12.5
  Bottom Layer w0.254: v1(20.3,23.98) 19.79,23.98 v1(18.78,25)
$2N2351: length 5.3
  Top Layer w0.381: R35.1 19.67,32.15 R34.2 20.3,29.33 U12.6

## Copper pours and planes (outline as drawn; the poured copper is in the pictures)
3V3 on Top Layer: 1.63,27.67 3.41,27.67 3.41,24.24 1.63,24.24
3V3 on Bottom Layer: 1.63,27.67 2.72,27.67 2.72,24.24 1.63,24.24
5V on Top Layer: 23.86,17.25 27.79,17.25 27.79,12.5 23.86,12.5
5V on Top Layer: 15.47,17.25 23.86,17.25 23.86,14.08 15.47,14.08
5V on Bottom Layer: 14.57,17.76 18.27,17.76 18.27,15.47 14.57,15.47
12V on Top Layer: 57.51,30.08 62.08,30.08 62.08,22.2 57.51,22.2
12V on Top Layer: 52.18,24.86 58.53,24.86 58.53,17.25 52.18,17.25
12V on Top Layer: 36.72,25.98 39.1,25.98 39.1,23.63 36.72,23.63
12V on Top Layer: 52.43,24.87 60.31,24.87 60.31,12.68 52.43,12.68
12V on Top Layer: 46.21,34.78 62.08,34.78 62.08,29.95 46.21,29.95
12V on Top Layer: 51.54,19.98 54.34,19.98 54.34,17.25 51.54,17.25
12V on Bottom Layer: 44.18,19.28 55.48,19.28 55.48,7.98 44.18,7.98
12V on Bottom Layer: 52.28,18.01 56.62,18.01 56.62,13.77 52.28,13.77
12V on Bottom Layer: 38.97,33 39.99,33 39.99,31.73 38.97,31.73
GND on Top Layer: -12.93,75.82 74.96,75.82 74.96,-8.38 -12.93,-8.38
GND on Bottom Layer: -135.24,64.31 -45.95,64.31 -45.95,-11.39 -135.24,-11.39
GND on Inner1: -6.24,73.77 69.83,73.77 69.83,-3.83 -6.24,-3.83
GND on Inner2: -2.43,71.48 73.77,71.48 73.77,-2.31 -2.43,-2.31
GND on Inner3: -7.26,66.02 68.43,66.02 68.43,-3.19 -7.26,-3.19
GND on Inner4: -7.77,69.32 72.88,69.32 72.88,-3.7 -7.77,-3.7
(no net) on Top Layer: 32.1,64.42 41.78,64.42 41.78,61.42 32.1,61.42
OUT_A on Top Layer: 37.79,60.8 40.87,60.8 40.87,56.8 37.79,56.8
OUT_A on Top Layer: 57.72,38.91 62.13,38.91 62.13,35.81 57.72,35.81
OUT_A on Bottom Layer: 57.76,42.91 62.08,42.91 62.08,39.98 57.76,39.98
OUT_A on Bottom Layer: 38.84,59.42 40.87,59.42 40.87,56.8 38.84,56.8
OUT_A on Bottom Layer: 57.76,44.12 62.08,44.12 62.08,42.91 57.76,42.91
OUT_B on Top Layer: 52,38.87 56.41,38.87 56.41,35.78 52,35.78
OUT_B on Top Layer: 35.54,60.81 38.31,60.81 38.31,56.75 35.54,56.75
OUT_B on Bottom Layer: 52.05,42.91 56.5,42.91 56.5,39.98 52.05,39.98
OUT_B on Bottom Layer: 35.54,59.42 38.31,59.42 38.31,56.75 35.54,56.75
OUT_B on Bottom Layer: 52.05,44.14 56.5,44.14 56.5,42.91 52.05,42.91
OUT_C on Top Layer: 33,60.81 36.09,60.81 36.09,56.76 33,56.76
OUT_C on Top Layer: 46.16,38.87 50.57,38.87 50.57,35.78 46.16,35.78
OUT_C on Bottom Layer: 46.23,44.17 50.64,44.17 50.64,42.9 46.23,42.9
OUT_C on Bottom Layer: 46.23,42.9 50.65,42.9 50.65,39.98 46.23,39.98
OUT_C on Bottom Layer: 33,59.42 34.99,59.42 34.99,56.76 33,56.76
SA_A+ on Top Layer: 57.26,50.27 62.13,50.27 62.13,43.92 57.26,43.92
SA_B+ on Top Layer: 50.53,50.26 56.41,50.26 56.41,43.92 50.53,43.92
SA_C+ on Top Layer: 44.3,49.64 50.64,49.64 50.64,43.94 44.3,43.94
$1N722 on Top Layer: 30.08,16.15 36.86,16.15 36.86,7.28 30.08,7.28
$2N447 on Top Layer: 44.3,12.63 50.65,12.63 50.65,6.46 44.3,6.46

Small or netless copper shapes (teardrops, artwork), in the pictures only: 4 on Top Layer, 4 on Bottom Layer

## Text on the board
Top Silkscreen Layer: By Chang / LAB 121, V2.0
